# Altium schematic sheet 主控板原理图 AD档.SchDoc
size A3
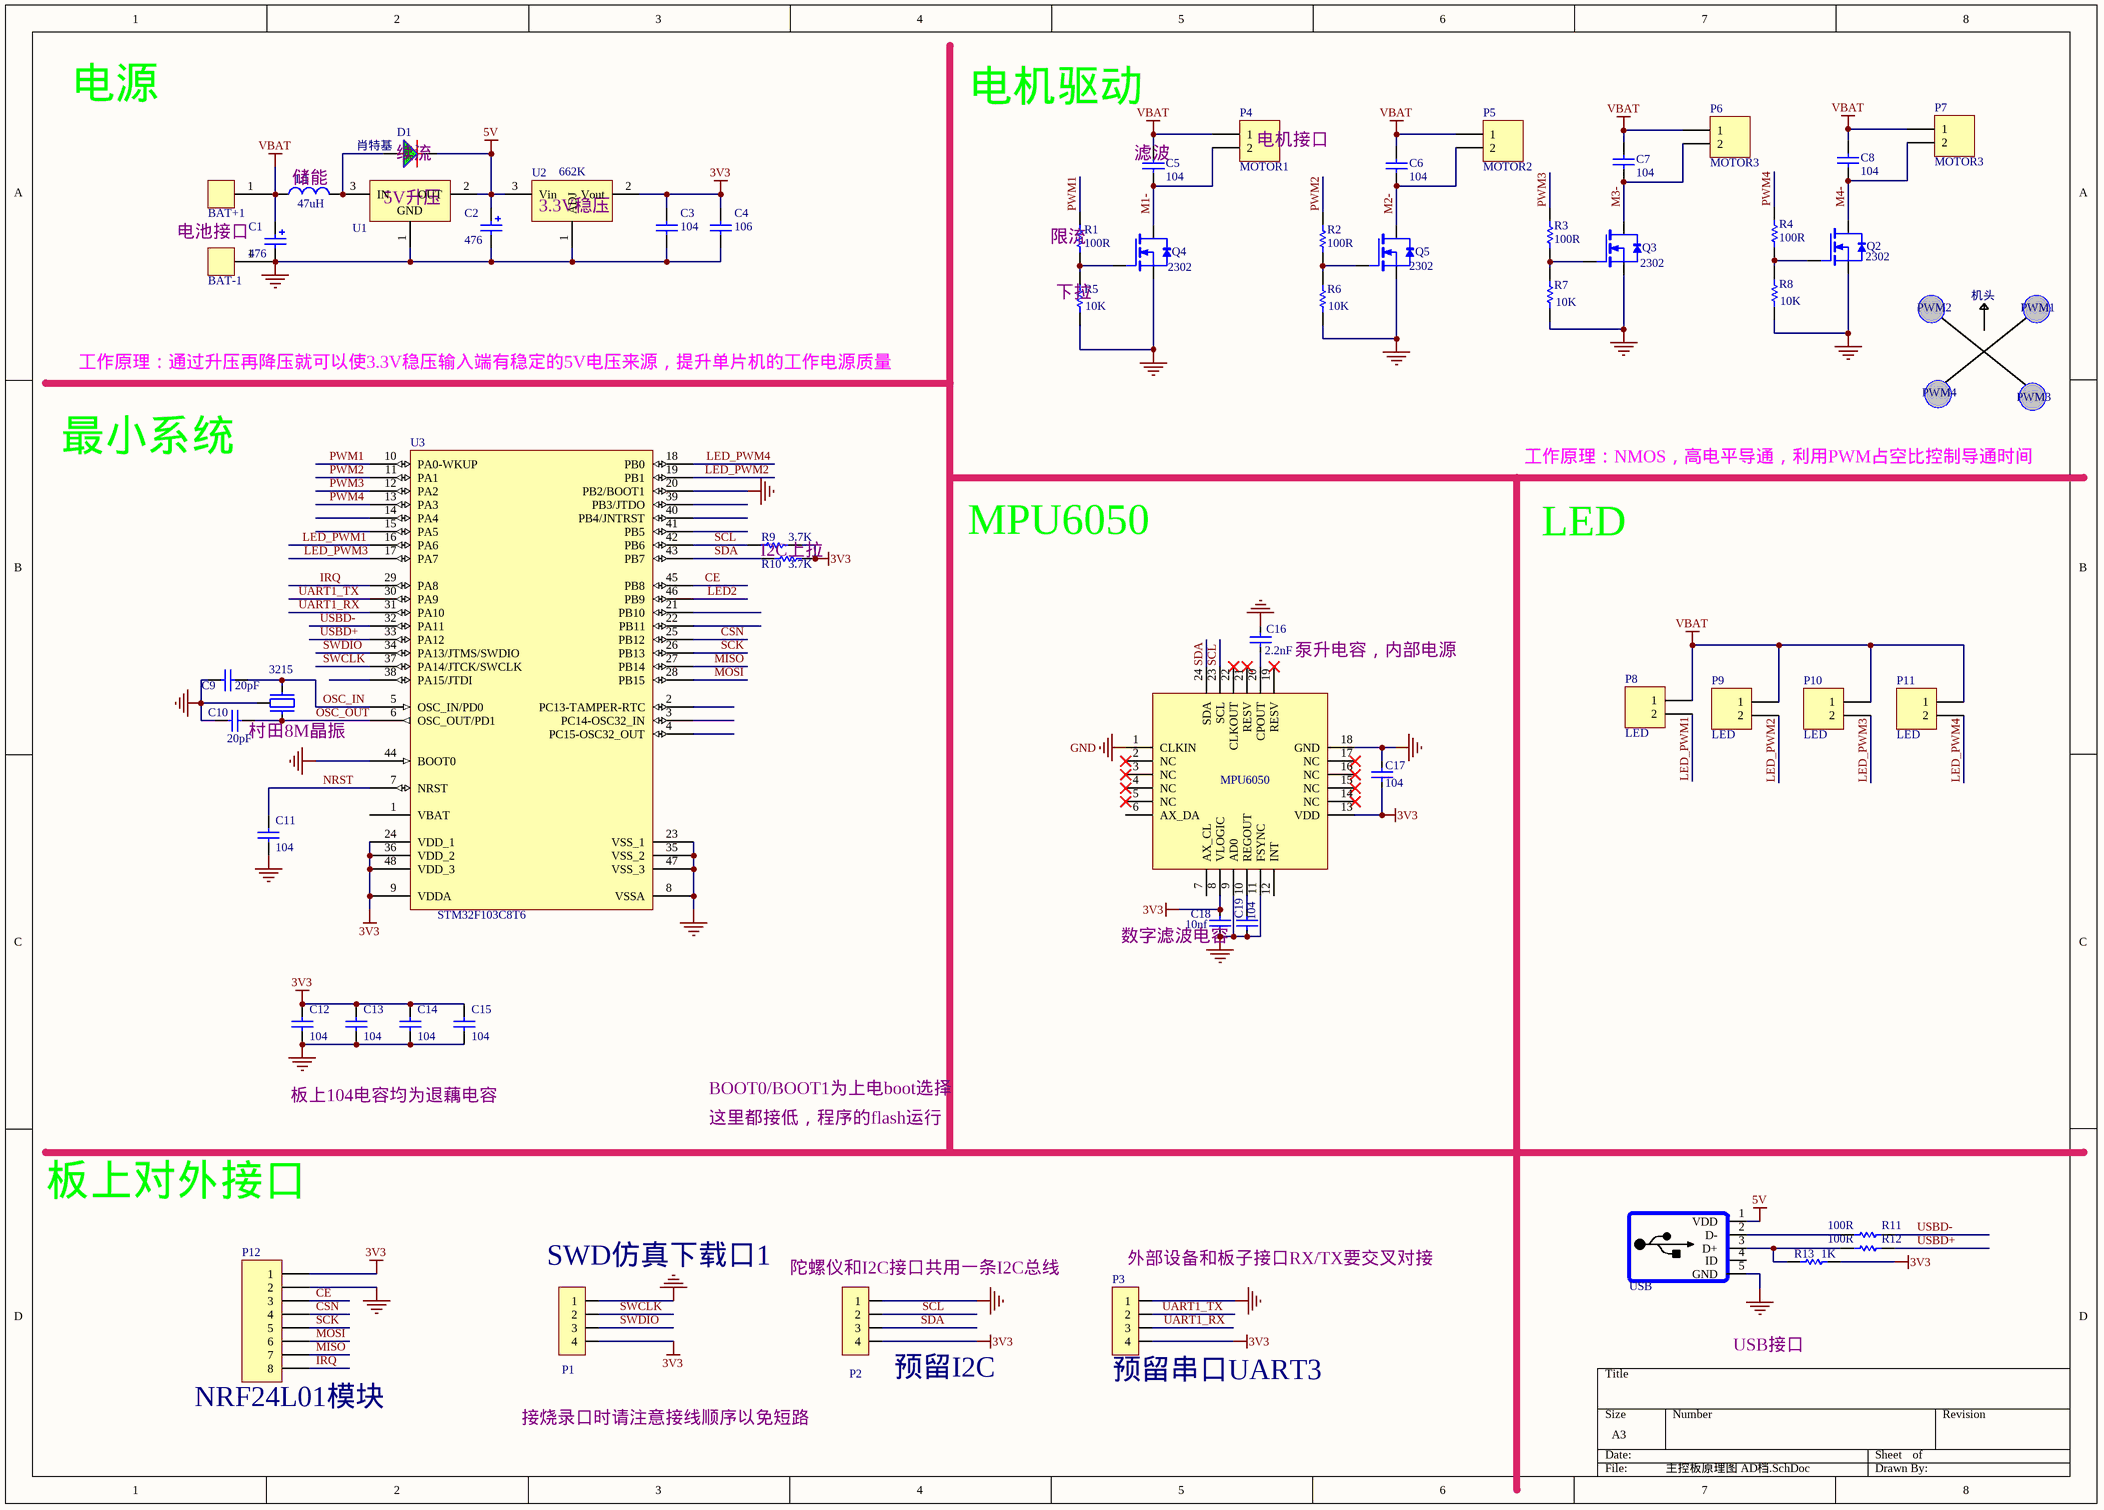
[diagram p0: 主控板原理图 AD档.SchDoc]

## Parts
3215  XTAL_SMT  [OSC]  (value not drawn)
*1  USB  [USB]
BAT+1  Header 1  [电池接口]  (value not drawn)
BAT-1  Header 1  [电池接口]  (value not drawn)
C1  value 476  [1206]  (hidden comment: Cap Tan A)
C2  value 476  [1206]  (hidden comment: Cap Tan A)
C3  value 104  [0603_C]  (hidden comment: Cap Chip 1206)
C4  value 106  [0603_c]  (hidden comment: Cap Chip 1206)
C5  value 104  [0603_C]  (hidden comment: Cap Chip 1206)
C6  104  [0603_C]
C7  value 104  [0603_C]  (hidden comment: Cap Chip 1206)
C8  value 104  [0603_C]  (hidden comment: Cap Chip 1206)
C9  20pF  [0603_C]
C10  20pF  [0603_C]
C11  104  [0603_C]
C12  104  [0603_C]
C13  104  [0603_C]
C14  104  [0603_C]
C15  104  [0603_C]
C16  value 2.2nF  [0603_C]  (hidden comment: Cap_0603)
C17  value 104  [0603_C]  (hidden comment: Cap_0603)
C18  value 10nf  [0603_C]  (hidden comment: Cap_0603)
C19  value 104  [0603_C]  (hidden comment: Cap_0603)
D1  肖特基  [0805D]
L1  value 47uH  [电感]  (hidden comment: Inductor Chip)
P3  预留串口UART3  [1.27*4]
P4  MOTOR1  [2P]
P5  MOTOR2  [2P]
P6  MOTOR3  [2P]
P7  MOTOR3  [2P]
P8  LED  [2P]
P9  LED  [2P]
P10  LED  [2P]
P11  LED  [2P]
P12  NRF24L01模块  [2.4G]
Q2  2302  [NMOS]
Q3  2302  [NMOS]
Q4  2302  [NMOS]
Q5  2302  [NMOS]
R1  value 100R  [0603_R]  (hidden comment: Res1)
R2  value 100R  [0603_R]  (hidden comment: Res1)
R3  value 100R  [0603_R]  (hidden comment: Res1)
R4  value 100R  [0603_R]  (hidden comment: Res1)
R5  value 10K  [0603_R]  (hidden comment: Res1)
R6  value 10K  [0603_R]  (hidden comment: Res1)
R7  value 10K  [0603_R]  (hidden comment: Res1)
R8  value 10K  [0603_R]  (hidden comment: Res1)
R9  value 3.7K  [0603_R]  (hidden comment: Res1)
R10  value 3.7K  [0603_R]  (hidden comment: Res1)
R11  value 100R  [0603_R]  (hidden comment: Res1)
R12  value 100R  [0603_R]  (hidden comment: Res1)
R13  value 1K  [0603R]  (hidden comment: Res1)
SWD仿真下载口1  P1  [1.27*4]
U1  7750  [SOT-89]  (value not drawn)
U2  662K  [LDO]
U3  STM32F103C8T6  [LQFP48]
U4  MPU6050  [QFN24]
预留I2C  P2  [1.27*4]

## Nets
3V3: C3.1 C4.1 C12.1 C13.1 C14.1 C15.1 C17.1 C18.2 P3.4 P12.1 R9.1 R10.1 R13.1 SWD仿真下载口1.4 U2.2(Vout) U3.9(VDDA) U3.24(VDD_1) U3.36(VDD_2) U3.48(VDD_3) U4.8(VLOGIC) U4.13(VDD) 预留I2C.4
5V: *1.1(VDD) C2.2 D1.2 U1.2(OUT) U2.3(Vin)
GND: 3215.0 *1.5(GND) BAT-1.1 C1.1 C2.1 C3.2 C4.2 C9.2 C10.2 C11.2 C12.2 C13.2 C14.2 C15.2 C16.2 C17.2 C18.1 C19.1 P3.1 P12.2 Q2.3(S) Q3.3(S) Q4.3(S) Q5.3(S) R5.1 R6.1 R7.1 R8.1 SWD仿真下载口1.1 U1.1(GND) U2.1(ADJ) U3.8(VSSA) U3.20(PB2/BOOT1) U3.23(VSS_1) U3.35(VSS_2) U3.44(BOOT0) U3.47(VSS_3) U4.1(CLKIN) U4.9(AD0) U4.11(FSYNC) U4.18(GND) 预留I2C.1
VBAT: BAT+1.1 C1.2 C5.2 C6.2 C7.2 C8.2 L1.1 P4.1 P5.1 P6.1 P7.1 P8.1 P9.1 P10.1 P11.1
CE: P12.3 U3.45(PB8)
CSN: P12.4 U3.25(PB12)
IRQ: P12.8 U3.29(PA8)
LED2: U3.46(PB9)
LED_PWM1: P8.2 U3.16(PA6)
LED_PWM2: P9.2 U3.19(PB1)
LED_PWM3: P10.2 U3.17(PA7)
LED_PWM4: P11.2 U3.18(PB0)
M1-: C5.1 P4.2 Q4.2(D)
M2-: C6.1 P5.2 Q5.2(D)
M3-: C7.1 P6.2 Q3.2(D)
M4-: C8.1 P7.2 Q2.2(D)
MISO: P12.7 U3.27(PB14)
MOSI: P12.6 U3.28(PB15)
NRST: C11.1 U3.7(NRST)
OSC_IN: 3215.2 C9.1 U3.5(OSC_IN/PD0)
OSC_OUT: 3215.1 C10.1 U3.6(OSC_OUT/PD1)
PWM1: R1.1 U3.10(PA0-WKUP)
PWM2: R2.1 U3.11(PA1)
PWM3: R3.1 U3.12(PA2)
PWM4: R4.1 U3.13(PA3)
SCK: P12.5 U3.26(PB13)
SCL: R9.2 U3.42(PB6) U4.23(SCL) 预留I2C.2
SDA: R10.2 U3.43(PB7) U4.24(SDA) 预留I2C.3
SWCLK: SWD仿真下载口1.2 U3.37(PA14/JTCK/SWCLK)
SWDIO: SWD仿真下载口1.3 U3.34(PA13/JTMS/SWDIO)
UART1_RX: P3.3 U3.31(PA10)
UART1_TX: P3.2 U3.30(PA9)
USBD+: R12.2 U3.33(PA12)
USBD-: R11.2 U3.32(PA11)
Net*1_2: *1.2(D-) R11.1
Net*1_3: *1.3(D+) R12.1 R13.2
NetC16_1: C16.1 U4.20(CPOUT)
NetC19_2: C19.2 U4.10(REGOUT)
NetD1_1: D1.1 L1.2 U1.3(IN)
NetQ2_1: Q2.1(G) R4.2 R8.2
NetQ3_1: Q3.1(G) R3.2 R7.2
NetQ4_1: Q4.1(G) R1.2 R5.2
NetQ5_1: Q5.1(G) R2.2 R6.2

Not connected (* = marked no-connect by the designer): *1 4(ID); U3 1(VBAT) 2(PC13-TAMPER-RTC) 3(PC14-OSC32_IN) 4(PC15-OSC32_OUT) 14(PA4) 15(PA5) 21(PB10) 22(PB11) 38(PA15/JTDI) 39(PB3/JTDO) 40(PB4/JNTRST) 41(PB5); U4 2(NC)* 3(NC)* 4(NC)* 5(NC)* 6(AX_DA) 7(AX_CL) 12(INT) 14(NC)* 15(NC)* 16(NC)* 17(NC)* 19(RESV)* 21(RESV)* 22(CLKOUT)*

## Notes on the sheet
- 电源
- 电机驱动
- (near D1) 续流
- (near C5) 滤波
- (near P4) 电机接口
- 电池接口
- (near L1) 储能
- (near U1) 5V升压
- (near U2) 3.3V稳压
- (near R1) 限流
- (near R5) 下拉
- PWM2
- 机头
- PWM1
- 工作原理：通过升压再降压就可以使3.3V稳压输入端有稳定的5V电压来源，提升单片机的工作电源质量
- PWM4
- PWM3
- 最小系统
- 工作原理：NMOS，高电平导通，利用PWM占空比控制导通时间
- I2C上拉
- MPU6050
- LED
- 泵升电容，内部电源
- 村田8M晶振
- 数字滤波电容
- 板上104电容均为退藕电容
- BOOT0/BOOT1为上电boot选择
- 这里都接低，程序的flash运行
- 板上对外接口
- (near 预留I2C) 陀螺仪和I2C接口共用一条I2C总线
- (near P3) 外部设备和板子接口RX/TX要交叉对接
- USB接口
- 接烧录口时请注意接线顺序以免短路

## Library data of the parts
C1 C2 = Cap Tan A: Polarized Capacitor (Radial); Voltage: 16V; Published: 8-Jun-2000; Revision: July-2002: Re-released for DXP Platform.; Publisher: Altium Limited
C3-C8 = Cap Chip 1206: Polarized Capacitor (Radial); Published: 8-Jun-2000; Revision: July-2002: Re-released for DXP Platform.; Publisher: Altium Limited
  C6: Value: 104
C9-C15 = C0603
C16-C19 = Cap_0603: Capacitor
D1 = DIODE
L1 = Inductor Chip: Inductor; Published: 8-Jun-2000; Revision: July-2002: Re-released for DXP Platform.; Publisher: Altium Limited
P3 SWD仿真下载口1 预留I2C = Header 4H: Header, 4-Pin, Right Angle; LatestRevisionDate: 17-Jul-2002; LatestRevisionNote: Re-released for DXP Platform.; Publisher: Altium Limited
P4-P11 = Header 2: Header, 2-Pin; LatestRevisionDate: 17-Jul-2002; LatestRevisionNote: Re-released for DXP Platform.; Publisher: Altium Limited
P12 = Header 8: Header, 8-Pin; LatestRevisionDate: 17-Jul-2002; LatestRevisionNote: Re-released for DXP Platform.; Publisher: Altium Limited
Q2 Q3 Q5 = N_MOS: N-Channel Power MOSFET
Q4 = N_MOS: N-Channel MOSFET
R1-R13 = Res1: Resistor; Published: 8-Jun-2000; LatestRevisionDate: 17-Jul-2002; LatestRevisionNote: Re-released for DXP Platform.; PackageReference: 0603_R; Publisher: Altium Limited; PackageDescription: Axial Device, Thru-Hole; 2 Leads; 0.3 in Pin Spacing
U1 = HT7750: POSITIVE OUTPUT VOLTAGE
U2 = LM317: 3-Terminal Adjustable Positive Voltage Regulator